# EAGLE design blink1disc_v1a (EAGLE 6.6.0)
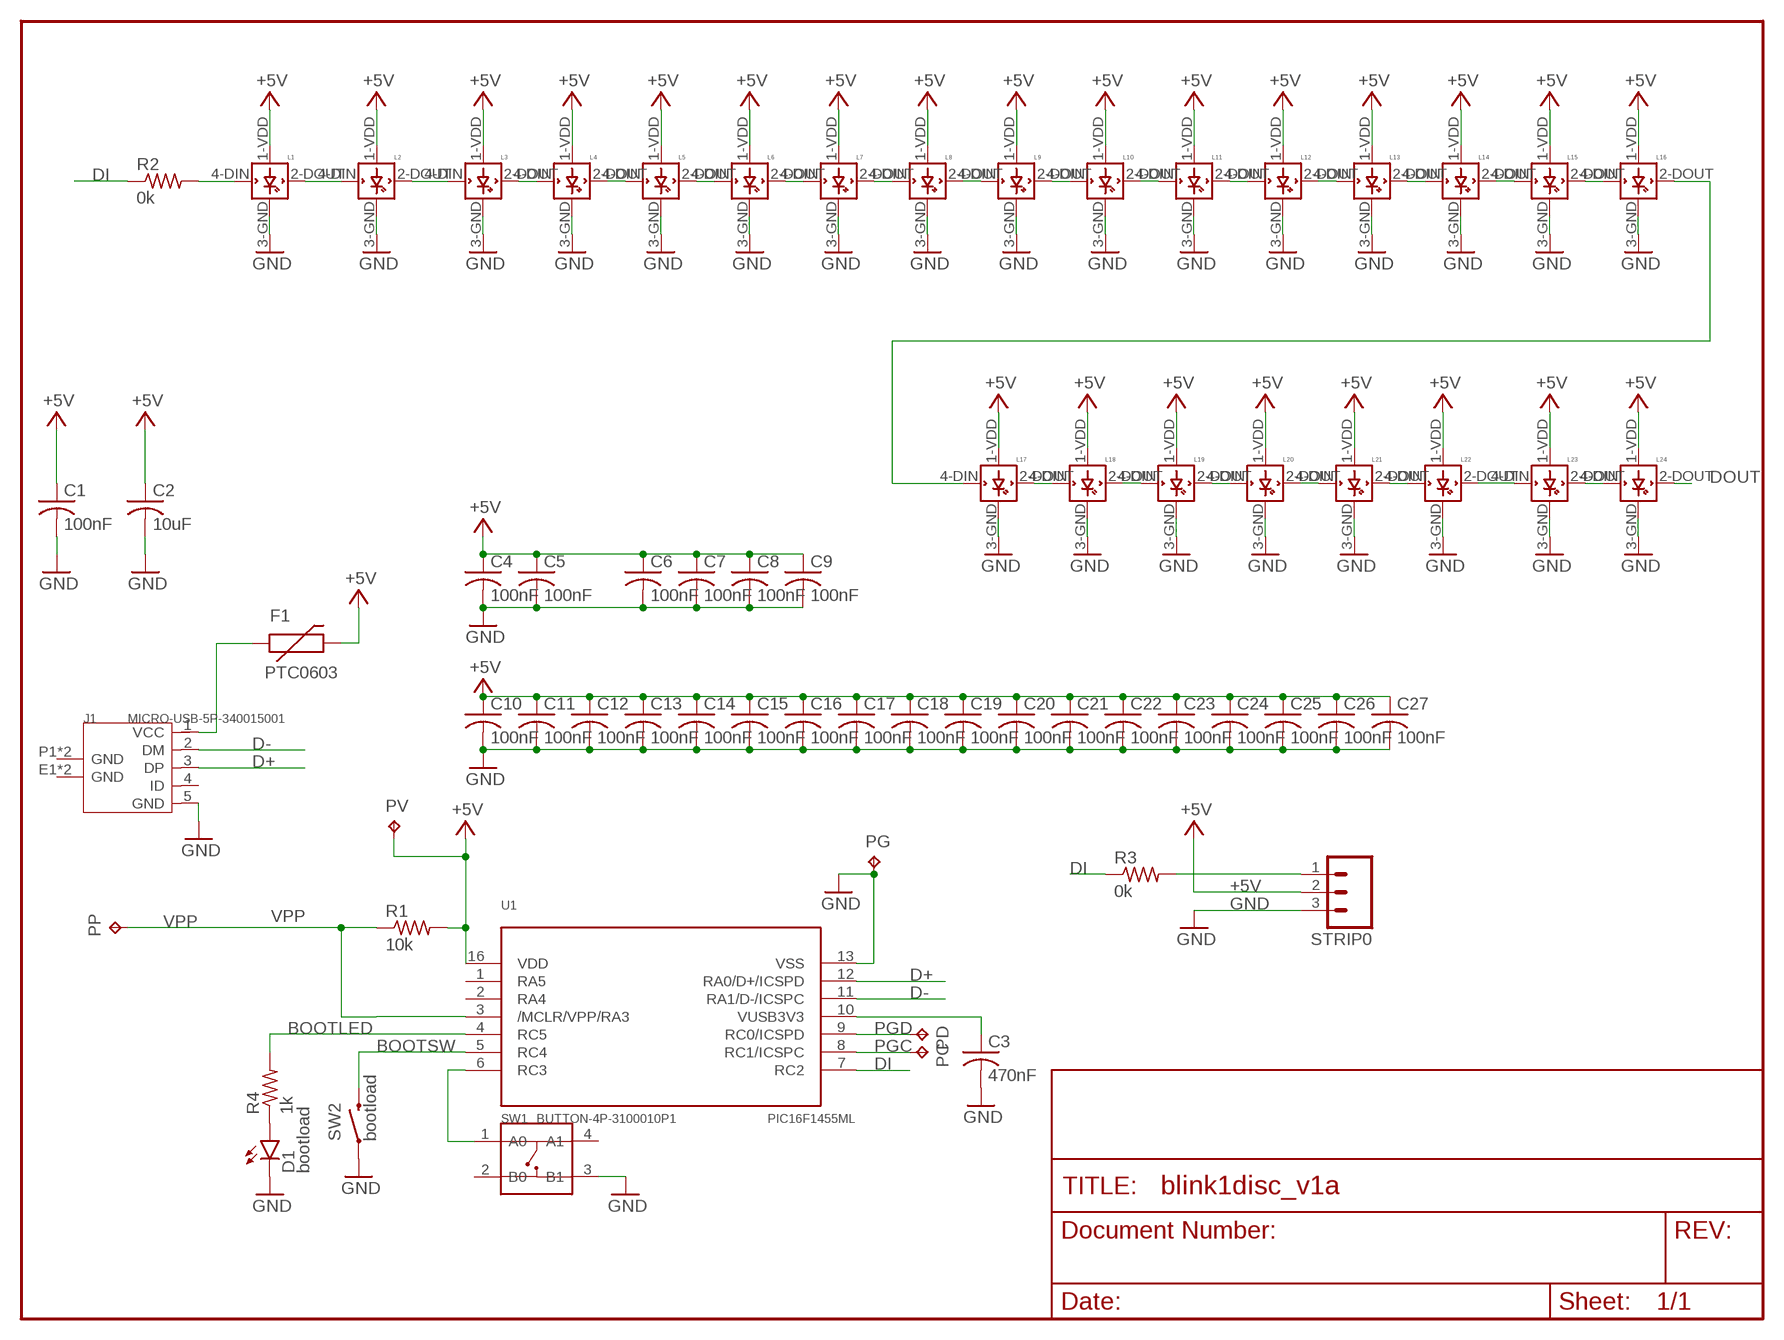
[diagram p0: schematic, sheet 1]

## Parts
C1  100nF  C-USC0603  [C0603]
C2  10uF  C-USC0603  [C0603]
C3  470nF  C-USC0603  [C0603]
C4  100nF  C-USC0603  [C0603]
C5  100nF  C-USC0603  [C0603]
C6  100nF  C-USC0603  [C0603]
C7  100nF  C-USC0603  [C0603]
C8  100nF  C-USC0603  [C0603]
C9  100nF  C-USC0603  [C0603]
C10  100nF  C-USC0603  [C0603]
C11  100nF  C-USC0603  [C0603]
C12  100nF  C-USC0603  [C0603]
C13  100nF  C-USC0603  [C0603]
C14  100nF  C-USC0603  [C0603]
C15  100nF  C-USC0603  [C0603]
C16  100nF  C-USC0603  [C0603]
C17  100nF  C-USC0603  [C0603]
C18  100nF  C-USC0603  [C0603]
C19  100nF  C-USC0603  [C0603]
C20  100nF  C-USC0603  [C0603]
C21  100nF  C-USC0603  [C0603]
C22  100nF  C-USC0603  [C0603]
C23  100nF  C-USC0603  [C0603]
C24  100nF  C-USC0603  [C0603]
C25  100nF  C-USC0603  [C0603]
C26  100nF  C-USC0603  [C0603]
C27  100nF  C-USC0603  [C0603]
D1  bootload  LED-RED0603  [LED-0603]
F1  PTC0603  [0603]
J1  MICRO-USB-5P-340015001  [B-SMD-5P]
L1  WS2812B  [WS2812B]
L2  WS2812B  [WS2812B]
L3  WS2812B  [WS2812B]
L4  WS2812B  [WS2812B]
L5  WS2812B  [WS2812B]
L6  WS2812B  [WS2812B]
L7  WS2812B  [WS2812B]
L8  WS2812B  [WS2812B]
L9  WS2812B  [WS2812B]
L10  WS2812B  [WS2812B]
L11  WS2812B  [WS2812B]
L12  WS2812B  [WS2812B]
L13  WS2812B  [WS2812B]
L14  WS2812B  [WS2812B]
L15  WS2812B  [WS2812B]
L16  WS2812B  [WS2812B]
L17  WS2812B  [WS2812B]
L18  WS2812B  [WS2812B]
L19  WS2812B  [WS2812B]
L20  WS2812B  [WS2812B]
L21  WS2812B  [WS2812B]
L22  WS2812B  [WS2812B]
L23  WS2812B  [WS2812B]
L24  WS2812B  [WS2812B]
PC  TPTP11SQ  [TP11SQ]
PD  TPTP11SQ  [TP11SQ]
PG  TPTP11SQ  [TP11SQ]
PP  TPTP11SQ  [TP11SQ]
PV  TPTP11SQ  [TP11SQ]
R1  10k  R-US_R0603  [R0603]
R2  0k  R-US_R0603  [R0603]
R3  0k  R-US_R0603  [R0603]
R4  1k  R-US_R0603  [R0603]
STRIP0  M03PTH  [1X03]
SW1  BUTTON-4P-3100010P1  [4P-SMD-6.0X6.0X5.0H]
SW2  bootload  SWITCH-MOMENTARY-2TACTILE-SWITCH-SMD-RIGHT-ANGLE  [TACTILE_SWITCH-SMD-RIGHT-ANGLE]
U1  PIC16F1455ML  [QFN16_4X4]

## Nets
+5V: C1.1 C2.1 C4.1 C5.1 C6.1 C7.1 C8.1 C9.1 C10.1 C11.1 C12.1 C13.1 C14.1 C15.1 C16.1 C17.1 C18.1 C19.1 C20.1 C21.1 C22.1 C23.1 C24.1 C25.1 C26.1 C27.1 F1.2 L1.1-VDD(VDD) L2.1-VDD(VDD) L3.1-VDD(VDD) L4.1-VDD(VDD) L5.1-VDD(VDD) L6.1-VDD(VDD) L7.1-VDD(VDD) L8.1-VDD(VDD) L9.1-VDD(VDD) L10.1-VDD(VDD) L11.1-VDD(VDD) L12.1-VDD(VDD) L13.1-VDD(VDD) L14.1-VDD(VDD) L15.1-VDD(VDD) L16.1-VDD(VDD) L17.1-VDD(VDD) L18.1-VDD(VDD) L19.1-VDD(VDD) L20.1-VDD(VDD) L21.1-VDD(VDD) L22.1-VDD(VDD) L23.1-VDD(VDD) L24.1-VDD(VDD) PV.TP R1.2 STRIP0.2 U1.16(VDD)
BOOTLED: R4.2 U1.4(RC5)
BOOTSW: SW2.2 U1.5(RC4)
D+: J1.3(DP) U1.12(RA0/D+/ICSPD)
D-: J1.2(DM) U1.11(RA1/D-/ICSPC)
DI: R2.1 R3.1 U1.7(RC2)
DO1: L2.2-DOUT(DOUT) L3.4-DIN(DIN)
DOUT: L24.2-DOUT(DOUT)
GND: C1.2 C2.2 C3.2 C4.2 C5.2 C6.2 C7.2 C8.2 C9.2 C10.2 C11.2 C12.2 C13.2 C14.2 C15.2 C16.2 C17.2 C18.2 C19.2 C20.2 C21.2 C22.2 C23.2 C24.2 C25.2 C26.2 C27.2 D1.C J1.5(GND) L1.3-GND(GND) L2.3-GND(GND) L3.3-GND(GND) L4.3-GND(GND) L5.3-GND(GND) L6.3-GND(GND) L7.3-GND(GND) L8.3-GND(GND) L9.3-GND(GND) L10.3-GND(GND) L11.3-GND(GND) L12.3-GND(GND) L13.3-GND(GND) L14.3-GND(GND) L15.3-GND(GND) L16.3-GND(GND) L17.3-GND(GND) L18.3-GND(GND) L19.3-GND(GND) L20.3-GND(GND) L21.3-GND(GND) L22.3-GND(GND) L23.3-GND(GND) L24.3-GND(GND) PG.TP STRIP0.3 SW1.3(B1) SW2.1 U1.13(VSS)
N$1: L3.2-DOUT(DOUT) L4.4-DIN(DIN)
N$2: L1.2-DOUT(DOUT) L2.4-DIN(DIN)
N$3: L5.2-DOUT(DOUT) L6.4-DIN(DIN)
N$4: L4.2-DOUT(DOUT) L5.4-DIN(DIN)
N$5: L7.2-DOUT(DOUT) L8.4-DIN(DIN)
N$6: L9.2-DOUT(DOUT) L10.4-DIN(DIN)
N$7: L8.2-DOUT(DOUT) L9.4-DIN(DIN)
N$8: L11.2-DOUT(DOUT) L12.4-DIN(DIN)
N$9: L13.2-DOUT(DOUT) L14.4-DIN(DIN)
N$10: L12.2-DOUT(DOUT) L13.4-DIN(DIN)
N$11: L1.4-DIN(DIN) R2.2
N$12: R3.2 STRIP0.1
N$14: L15.2-DOUT(DOUT) L16.4-DIN(DIN)
N$15: L14.2-DOUT(DOUT) L15.4-DIN(DIN)
N$16: SW1.1(A0) U1.6(RC3)
N$17: L6.2-DOUT(DOUT) L7.4-DIN(DIN)
N$18: L17.2-DOUT(DOUT) L18.4-DIN(DIN)
N$21: D1.A R4.1
N$22: L19.2-DOUT(DOUT) L20.4-DIN(DIN)
N$23: L18.2-DOUT(DOUT) L19.4-DIN(DIN)
N$24: L21.2-DOUT(DOUT) L22.4-DIN(DIN)
N$25: L20.2-DOUT(DOUT) L21.4-DIN(DIN)
N$26: L23.2-DOUT(DOUT) L24.4-DIN(DIN)
N$27: L22.2-DOUT(DOUT) L23.4-DIN(DIN)
N$28: L16.2-DOUT(DOUT) L17.4-DIN(DIN)
N$29: L10.2-DOUT(DOUT) L11.4-DIN(DIN)
PGC: PC.TP U1.8(RC1/ICSPC)
PGD: PD.TP U1.9(RC0/ICSPD)
VPP: PP.TP R1.1 U1.3(/MCLR/VPP/RA3)
VUSB: F1.1 J1.1(VCC)
VUSB3V3: C3.1 U1.10(VUSB3V3)
Unconnected: J1.4(ID) J1.E1(GND) J1.E2(GND) J1.P1(GND) J1.P2(GND) SW1.2(B0) SW1.4(A1) U1.1(RA5) U1.2(RA4)

## Library data of the parts
C1-C27 = rcl:C-US: CAPACITOR, American symbol
D1 = SparkFun-LED:LED-RED: Assorted Red LEDs LilyPad 1206- DIO-09912 1206- DIO-00809 0603- DIO-00819; PROD_ID: DIO-00819; VALUE: RED
F1 = SparkFun-PowerIC:PTC: Resettable Fuse PTC Resettable Fuse. Spark Fun Electronics SKU : COM-08357
J1 = OPL Eagle Library:MICRO-USB-5P: ST-USB-001E：MICRO USB B SMD R/A
L1-L24 = adafruit:WS2812B
PC PD PG PP PV = testpad:TP: Test pad
R1-R4 = rcl:R-US_: RESISTOR, American symbol
STRIP0 = SparkFun-Connectors:M03: Header 3 Standard 3-pin 0.1" header. Use with straight break away headers (SKU : PRT-00116), right angle break away headers (PRT-00553), swiss pins (PRT-00743), machine pins (PRT-00117), and female headers (PRT-00115). Molex polarized connector foot print use with SKU : PRT-08232 with associated crimp pins and housings.
SW1 = OPL Eagle Library:BUTTON-4P
SW2 = SparkFun-Electromechanical:SWITCH-MOMENTARY-2: Various NO switches- pushbuttons, reed, etc; PROD_ID: COMP-12265
U1 = todstuffnew:PIC16F1455

## Board
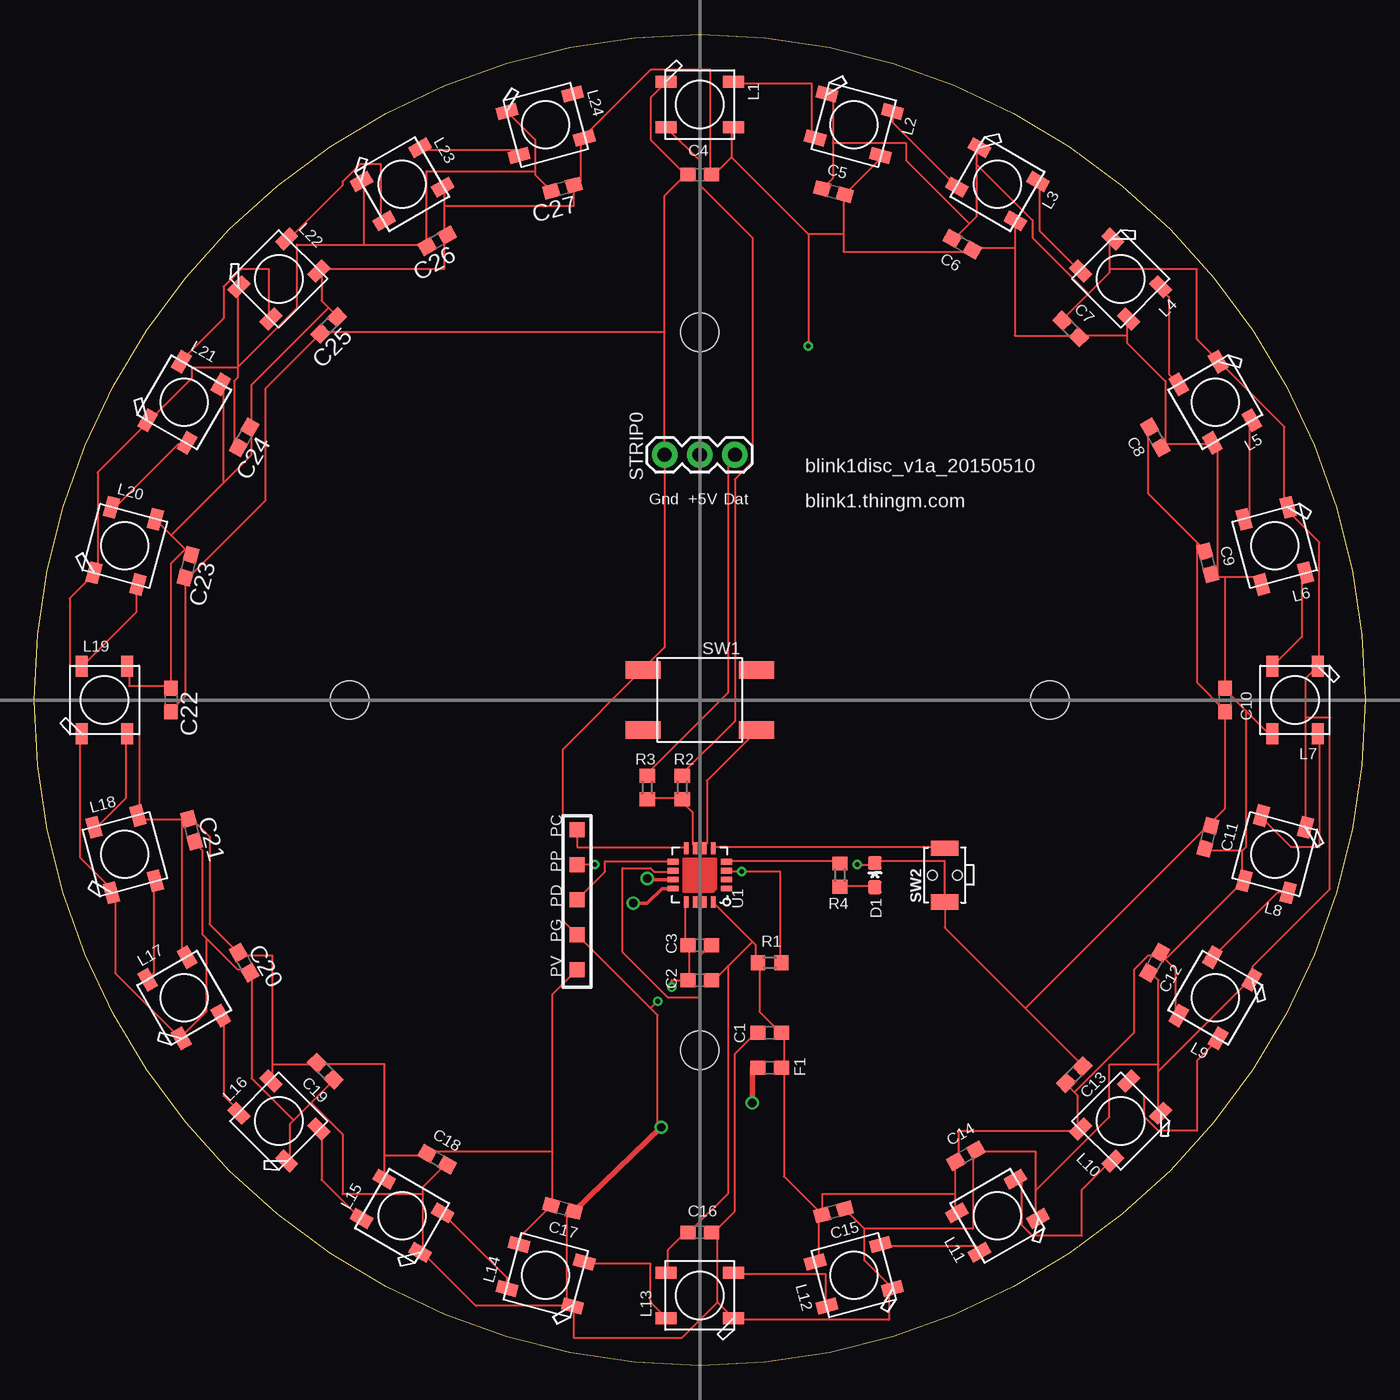
[diagram p1: board, top side]
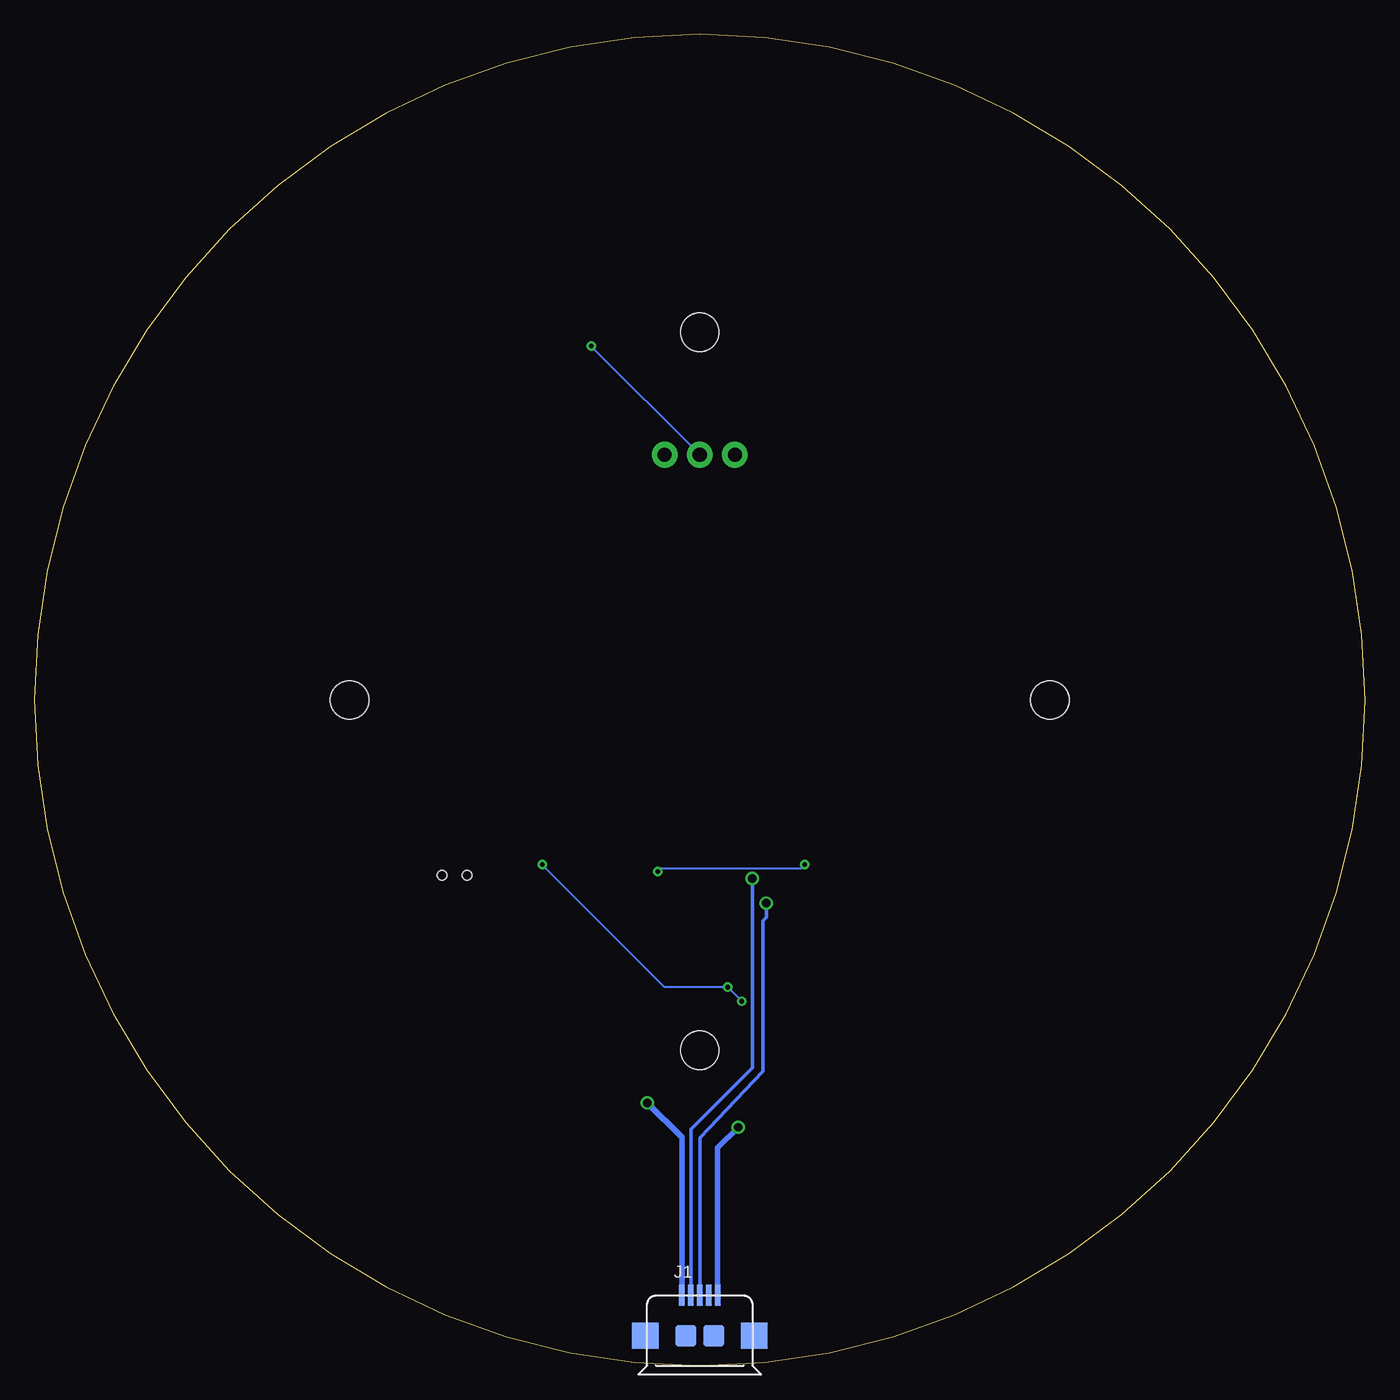
[diagram p2: board, bottom side, seen from below]

Size 96.52 x 96.52 mm. Coordinates in mm from the lower left corner, seen from the top.
Outline: 48.26,96.52 arc-180 48.26,0 arc-180 48.26,96.52
Copper layers (1*16): Top 0.0356mm / dielectric 1.5011mm / Bottom 0.0356mm
Design rules "LaenPCBOrder *": minimum track width 6mil, minimum drill 13mil, track to track 6mil, track to pad 6mil, pad to pad 6mil, via to via 6mil, smd to smd 6mil, copper to edge 15mil, drill to drill 6mil, minimum pad ring 7mil, minimum via ring 7mil, stop-mask expansion 3mil, vias tented up to drill 25mil, thermal gap 10mil
Holes 2.8 mm at 22.86,48.26 73.66,48.26 48.26,22.86 48.26,74.93

### Footprints (pad centres in the part's own frame; a part is rotated, then mirrored left to right if it is on the bottom)
C0603 = smd 1.1 x 1: 1 -0.85,0; 2 0.85,0
LED-0603 = smd 1 x 1: A 0,-0.877; C 0,0.877
0603 = smd 1.1 x 1: 1 -0.85,0; 2 0.85,0
B-SMD-5P = smd 0.38 x 1.52: 1 -1.3,2.54; 2 -0.65,2.54; 3 0,2.54; 4 0.65,2.54; 5 1.3,2.54 | smd 1.524 x 1.524: E1 -1.016,-0.381; E2 1.016,-0.381 | smd 1.9 x 1.9: P1 -3.95,-0.381; P2 3.95,-0.381
WS2812B = smd 1.5 x 0.9: 1-VDD 2.45,-1.65; 2-DOUT 2.45,1.65; 3-GND -2.45,1.65; 4-DIN -2.45,-1.65
TP11SQ = smd 1.1 x 1.1: TP 0,0
R0603 = smd 1 x 1.1: 1 -0.85,0; 2 0.85,0
1X03 = drill 1.016 pad 1.88: 1 0,0; 2 2.54,0; 3 5.08,0
4P-SMD-6.0X6.0X5.0H = smd 2.54 x 1.27: 1 -4.129,2.159; 2 -4.129,-2.159; 3 4.129,-2.159; 4 4.129,2.159
TACTILE_SWITCH-SMD-RIGHT-ANGLE = smd 1.1 x 2: 1 -1.95,0; 2 1.95,0 | hole 0.7: 0,0.9; 0,-0.9
QFN16_4X4 = smd 0.8 x 0.35: 1 -1.95,0.975; 2 -1.95,0.325; 3 -1.95,-0.325; 4 -1.95,-0.975; 9 1.95,-0.975; 10 1.95,-0.325; 11 1.95,0.325; 12 1.95,0.975 | smd 0.35 x 0.8: 5 -0.975,-1.95; 6 -0.325,-1.95; 7 0.325,-1.95; 8 0.975,-1.95; 13 0.975,1.95; 14 0.325,1.95; 15 -0.325,1.95; 16 -0.975,1.95

### Placement (x,y rotation side)
C1  53.34,24.13 180 top
C2  48.26,27.94 180 top
C3  48.26,30.48 180 top
C4  48.26,86.36 180 top
C5  57.96,85.12 165 top
C6  67.31,81.3 150 top
C7  75.17,75.17 135 top
C8  81.3,67.31 120 top
C9  85.12,58.21 105 top
C10  86.36,48.26 270 top
C11  85.12,38.31 75 top
C12  81.26,29.21 240 top
C13  75.42,21.1 45 top
C14  67.56,15.22 30 top
C15  57.96,11.15 15 top
C16  48.26,9.65 0 top
C17  38.31,11.4 345 top
C18  29.21,14.96 330 top
C19  21.1,21.35 315 top
C20  15.22,29.21 300 top
C21  11.4,38.82 285 top
C22  9.91,48.26 270 top
C23  11.15,57.96 255 top
C24  15.22,67.31 240 top
C25  21.35,75.42 225 top
C26  29.21,81.56 210 top
C27  38.31,85.37 195 top
D1  60.96,35.56 0 top
F1  53.34,21.59 0 top
J1  48.26,2.54 0 bottom
L1  48.26,91.44 0 top
L2  59.44,89.97 345 top
L3  69.85,85.65 330 top
L4  78.79,78.79 315 top
L5  85.65,69.85 300 top
L6  89.97,59.44 285 top
L7  91.44,48.26 270 top
L8  89.97,37.08 255 top
L9  85.65,26.67 240 top
L10  78.79,17.73 225 top
L11  69.85,10.87 210 top
L12  59.44,6.55 195 top
L13  48.26,5.08 180 top
L14  37.08,6.55 165 top
L15  26.67,10.87 150 top
L16  17.73,17.73 135 top
L17  10.87,26.67 120 top
L18  6.55,37.08 105 top
L19  5.08,48.26 90 top
L20  6.55,59.44 75 top
L21  10.87,69.85 60 top
L22  17.73,78.79 45 top
L23  26.67,85.65 30 top
L24  37.08,89.97 15 top
PC  39.37,38.86 90 top
PD  39.37,33.78 90 top
PG  39.37,31.24 90 top
PP  39.37,36.32 0 top
PV  39.37,28.7 90 top
R1  53.34,29.21 180 top
R2  46.99,41.91 90 top
R3  44.45,41.91 90 top
R4  58.42,35.56 90 top
STRIP0  50.8,66.04 180 top
SW1  48.26,48.26 180 top
SW2  66.04,35.56 90 top
U1  48.26,35.56 180 top

### Tracks (layer width: path | path; a pad name or v marks a point on that pad's centre or on a via)
+5V  (via drill 0.33)
  Top 0.152: 17.27,21.84 20.32,21.84 C19.1 20.57,21.84 25.4,21.84 25.4,15.24 | 17.27,21.84 17.27,20.83 L16.1-VDD | 17.27,21.84 17.27,29.72 14.99,29.72 C20.1 14.73,29.97 12.7,32 12.7,38.35 11.43,39.62 C21.1 | 25.4,15.24 28.45,15.24 C18.1 28.7,15.49 37.59,15.49 | 25.4,15.24 25.4,13.72 L15.1-VDD | L14.1-VDD 35.31,8.89 35.31,9.4 37.34,11.43 C17.1 37.59,11.68 37.59,15.49 | PV.TP 37.59,26.92 37.59,15.49 | 21.34,76.71 20.83,77.22 20.83,79.25 L22.1-VDD 20.83,79.5 29.72,79.5 29.72,81.79 C26.1 29.72,82.04 29.72,84.07 | 21.34,76.71 21.84,76.2 C25.1 | 29.72,84.07 29.72,85.34 L23.1-VDD | 29.72,84.07 39.12,84.07 39.12,85.34 C27.1 39.37,85.6 39.62,85.85 39.62,88.9 L24.1-VDD 39.88,89.15 44.7,93.98 49.02,93.98 49.02,86.36 C4.1 49.28,86.36 50.55,87.63 | 9.91,60.2 8.89,61.21 L20.1-VDD | 9.91,60.2 10.92,59.18 | 10.92,59.18 11.18,58.93 C23.1 | 9.91,60.2 13.72,64.01 | 13.72,64.01 15.75,66.04 15.75,67.82 C24.1 15.75,68.07 15.75,71.12 21.34,76.71 | 13.72,64.01 13.72,71.12 L21.1-VDD | 7.62,49.28 6.86,49.28 6.86,50.55 L19.1-VDD | 7.62,49.28 9.91,49.28 | 9.91,49.28 C22.1 9.91,49.28 | 10.67,39.62 7.62,39.62 L18.1-VDD 7.62,39.88 7.62,49.28 | 10.67,39.62 11.18,39.62 C21.1 | 10.67,39.62 10.67,29.97 10.92,29.72 L17.1-VDD | 10.67,39.62 C21.1 | 10.92,59.18 9.91,58.17 9.91,49.28 | L13.1-VDD 45.97,6.86 45.97,8.38 47.24,9.65 C16.1 47.5,9.65 50.29,12.45 50.29,28.96 | 75.44,19.81 75.69,19.56 75.69,17.27 L10.1-VDD 75.69,17.02 67.06,17.02 67.06,14.99 C14.1 66.8,14.73 66.8,12.45 | 75.44,19.81 74.93,20.32 C13.1 | 66.8,12.45 66.8,11.18 L11.1-VDD | C15.1 56.9,10.92 56.9,7.62 L12.1-VDD | 54.36,21.59 54.36,24.13 C1.1 54.1,24.13 52.58,25.65 52.58,29.21 R1.2 52.32,29.21 52.32,30.48 52.07,30.73
  Top 0.152: 54.36,21.59 F1.2 54.36,21.59 | 52.07,30.73 49.28,33.53 U1.16 | 52.07,30.73 50.29,28.96 | 50.29,28.96 49.28,27.94 C2.1 | 54.36,21.59 54.36,13.72 56.9,11.18 C15.1 | 66.8,12.45 57.15,12.45 57.15,11.18 C15.1 | 87.63,37.34 85.09,37.34 C11.1 | 87.63,37.34 87.63,35.31 L8.1-VDD 87.63,35.05 82.04,29.46 | 82.04,29.46 82.8,28.7 82.8,25.4 L9.1-VDD | 82.04,29.46 81.79,29.72 C12.1 81.53,29.72 80.77,29.72 79.76,28.7 79.76,24.13 75.44,19.81 | 87.88,47.5 89.66,45.72 L7.1-VDD | 87.88,47.5 86.36,49.02 C10.1 86.36,49.28 86.36,57.15 | 82.04,66.8 85.34,66.8 L5.1-VDD 85.6,66.8 85.85,66.55 85.85,57.15 | 82.04,66.8 81.79,66.8 C8.1 82.04,66.8 | 86.36,57.15 88.9,57.15 88.9,56.9 L6.1-VDD | 86.36,57.15 85.85,57.15 | 85.85,57.15 85.34,57.15 C9.1 85.85,57.15 | 87.63,37.34 87.88,37.59 87.88,47.5 | 79.25,74.68 75.95,74.68 C7.1 75.69,74.68 71.12,74.68 71.12,81.03 | 79.25,74.68 79.25,75.69 L4.1-VDD | 71.12,81.03 68.07,81.03 C6.1 67.82,80.77 58.67,80.77 58.67,82.04 | 71.12,81.03 71.12,82.8 L3.1-VDD | 50.55,87.63 50.55,89.66 L1.1-VDD | L2.1-VDD 61.21,87.63 61.21,87.38 58.93,85.09 C5.1 58.67,84.84 58.67,82.04 | 56.13,82.04 50.55,87.63 | 58.67,82.04 56.13,82.04 | 56.13,82.04 v56.13,73.91 | 82.04,66.8 82.04,71.37 79.25,74.17 79.25,74.68
  Bottom 0.152: v56.13,73.91 STRIP0.2
BOOTLED
  Top 0.152: U1.4 50.29,36.58 58.42,36.58 R4.2
BOOTSW
  Top 0.152: U1.5 49.28,37.59 66.04,37.59 SW2.2
D+  (via drill 0.61)
  Top 0.254: U1.12 45.51,34.59 44.45,33.53 v43.43,33.53
  Bottom 0.254: J1.3 48.26,16.51 43.69,21.34 43.69,32.26 43.43,32.51 v43.43,33.53
D-  (via drill 0.61)
  Top 0.254: U1.11 45.4,35.23 44.52,35.23 v44.45,35.31
  Bottom 0.254: J1.2 48.91,17.13 44.45,21.59 v44.45,35.31
DI
  Top 0.152: U1.7 48.01,37.59 47.75,37.85 47.75,40.13 46.99,40.89 R2.1 46.99,41.15 44.45,41.15 R3.1
DO1
  Top 0.152: L3.4-DIN 66.8,85.6 62.23,90.17 62.23,90.68 L2.2-DOUT
GND  (via drill 0.33, 0.6)
  Top 0.152: 76.45,77.72 77.98,79.25 77.98,79.5 | 76.45,77.72 74.68,75.95 C7.2 | 77.98,79.5 77.98,81.53 L4.3-GND | 57.91,88.65 57.91,91.69 57.66,91.95 L2.3-GND | 57.91,88.65 57.91,86.11 C5.2 | 67.82,82.8 68.33,83.31 68.33,87.12 | 67.82,82.8 66.8,81.79 C6.2 | 68.33,87.12 68.33,88.14 L3.3-GND | 57.91,88.65 63.25,88.65 63.25,87.38 67.82,82.8 | 76.45,77.72 72.39,81.79 72.39,83.06 68.33,87.12 | 92.2,46.99 92.2,49.78 92.96,50.55 L7.3-GND 93.22,50.8 93.22,59.69 90.93,61.98 L6.3-GND 90.68,62.23 90.68,68.07 86.11,72.64 L5.3-GND 85.85,72.9 84.33,74.42 84.33,79.5 77.98,79.5 | 92.2,46.99 92.2,39.12 L8.3-GND | C22.2 9.91,47.5 10.92,48.51 10.92,56.9 C23.2 11.18,57.15 16.76,62.74 16.76,70.87 20.57,74.68 C25.2 20.83,74.93 45.72,74.93 | 47.24,86.36 44.7,88.9 44.7,91.95 45.72,92.96 L1.3-GND | 47.24,86.36 C4.2 47.24,86.36 | 47.24,86.36 45.72,84.84 45.72,74.93 | 45.72,74.93 STRIP0.3 45.72,52.07 44.2,50.55 SW1.3 43.94,50.29 38.35,44.7 38.35,32.26 PG.TP 44.7,25.91 | 71.88,25.91 66.04,31.75 66.04,33.53 SW2.1 66.04,33.78 66.04,36.58 60.96,36.58 D1.C 60.96,36.32 v59.69,36.32 | 71.88,25.91 75.95,21.84 C13.2 | 84.33,59.69 80.77,63.25 80.77,67.82 C8.2 | 84.33,59.69 84.84,59.18 C9.2 | 84.33,59.69 84.33,49.53 86.36,47.5 C10.2 86.36,47.24 86.36,40.39 85.34,39.37 C11.2 85.09,39.12 71.88,25.91 | 49.28,9.65 49.53,9.4 49.53,4.57 | 49.53,4.57 50.55,3.56 L13.3-GND 50.8,3.3 61.98,3.3 61.98,5.59 L12.3-GND 61.98,5.84 60.2,7.62 60.2,9.91 | 49.28,9.65 C16.2 49.28,9.65 | 49.28,9.65 50.8,11.18 50.8,22.61 52.32,24.13 C1.2 | 81.53,21.34 81.53,18.54 L10.3-GND | 81.53,21.34 81.53,21.84 | 81.53,21.84 81.53,27.94 81.03,28.45 C12.2
  Top 0.152: 81.53,21.34 88.14,27.94 L9.3-GND 88.39,28.19 88.39,28.96 93.98,34.54 93.98,46.99 92.2,46.99 | 60.2,9.91 58.93,11.18 C15.2 | 72.64,12.7 72.64,10.67 L11.3-GND | 72.64,12.7 72.64,15.49 68.33,15.49 C14.2 68.07,15.49 68.07,9.91 60.2,9.91 | 81.53,21.84 77.98,21.84 77.98,18.03 72.64,12.7 | 28.19,12.45 28.19,8.38 L15.3-GND 28.19,8.13 32,4.32 38.86,4.32 L14.3-GND | 28.19,12.45 28.19,12.95 29.72,14.48 C18.2 | U1.13 47.24,33.53 47.24,30.48 C3.2 47.5,30.48 47.5,27.94 C2.2 47.24,27.94 46.23,27.94 v46.23,27.43 | 44.7,25.91 45.21,25.4 45.21,17.27 v45.47,17.27 | L14.3-GND 38.86,4.57 38.61,4.83 38.61,10.67 39.12,11.18 C17.2 | 44.7,25.91 v45.21,26.42 | 18.8,17.78 18.54,17.53 18.54,14.99 L16.3-GND | 18.8,17.78 20.07,19.05 | 20.07,19.05 21.59,20.57 C19.2 | 12.45,30.99 14.73,28.7 15.49,28.7 C20.2 15.75,28.45 15.75,20.83 18.8,17.78 | 12.45,30.99 12.19,31.24 12.19,37.34 11.68,37.85 C21.2 | 12.45,30.99 12.45,25.65 10.67,23.88 L17.3-GND 10.41,23.88 5.84,28.45 5.84,34.29 L18.3-GND 5.59,34.54 3.3,36.83 3.3,45.72 L19.3-GND 3.3,45.97 2.54,46.74 2.54,55.63 4.32,57.4 L20.3-GND 4.57,57.66 4.57,64.77 8.13,68.33 L21.3-GND 8.38,68.58 11.43,71.63 11.43,72.39 14.73,72.39 | 36.32,86.61 36.32,88.9 34.54,90.68 L24.3-GND | 36.32,86.61 36.32,86.36 37.34,85.34 C27.2 | 23.88,81.28 28.45,81.28 | 23.88,81.28 23.88,85.85 L23.3-GND | 28.45,81.28 C26.2 28.45,81.28 | 36.32,86.61 28.45,86.61 28.45,81.28 | 14.73,72.39 14.73,77.98 L22.3-GND | 14.73,72.39 14.73,71.63 14.48,71.37 14.48,67.06 14.73,66.8 C24.2 | 23.88,81.28 19.05,81.28 19.05,76.71 14.73,72.39 | 28.19,12.45 22.35,12.45 22.35,16.76 20.07,19.05 | 49.53,4.57 46.99,2.03 39.12,2.03 39.12,4.32 L14.3-GND
  Top 0.406: v45.47,17.27 C17.2
  Bottom 0.152: v45.21,26.42 v46.23,27.43 50.8,27.43 v59.69,36.32
  Bottom 0.406: J1.5 46.96,15.78 v45.47,17.27
N$1
  Top 0.152: L4.4-DIN 75.69,79.5 72.9,82.3 72.9,85.85 L3.2-DOUT
N$2
  Top 0.152: L1.2-DOUT 50.8,92.96 56.39,92.96 56.39,89.41 56.64,89.15 L2.4-DIN
N$3
  Top 0.152: L6.4-DIN 87.88,61.47 88.14,61.72 88.14,68.33 L5.2-DOUT
N$4
  Top 0.152: L5.4-DIN 82.8,71.37 82.3,71.88 82.3,77.47 81.79,77.98 L4.2-DOUT
N$5
  Top 0.152: L8.4-DIN 89.15,39.62 91.19,37.59 93.22,37.59 93.22,45.72 L7.2-DOUT
N$6
  Top 0.152: L10.4-DIN 79.5,20.57 80.52,19.56 80.52,18.03 81.53,17.02 84.33,17.02 84.33,22.1 85.85,23.62 L9.2-DOUT
N$7
  Top 0.152: L9.4-DIN 85.6,29.72 90.17,34.29 90.68,34.29 L8.2-DOUT
N$8
  Top 0.152: L12.4-DIN 61.47,8.64 68.33,8.64 68.33,8.38 L11.2-DOUT
N$9
  Top 0.152: L14.4-DIN 39.88,7.37 44.7,7.37 44.7,4.57 45.72,3.56 L13.2-DOUT
N$10
  Top 0.152: L13.4-DIN 50.8,6.6 57.4,6.6 57.4,4.57 L12.2-DOUT
N$11
  Top 0.152: R2.2 46.99,42.93 50.8,46.74 50.8,64.26 52.07,65.53 52.07,81.79 48.26,85.6 48.26,87.38 45.97,89.66 L1.4-DIN
N$12
  Top 0.152: STRIP0.1 50.29,65.53 50.29,48.77 44.45,42.93 R3.2
N$14
  Top 0.152: L15.2-DOUT 23.62,10.67 20.83,13.46 20.83,17.02 L16.4-DIN
N$15
  Top 0.152: L15.4-DIN 29.72,10.92 34.29,6.35 34.29,5.84 L14.2-DOUT
N$16
  Top 0.152: U1.6 48.51,37.59 48.77,37.85 48.77,42.42 52.32,45.97 SW1.1
N$17
  Top 0.152: L7.4-DIN 89.92,50.8 91.95,52.83 91.95,57.4 L6.2-DOUT
N$18
  Top 0.152: L17.2-DOUT 8.38,28.19 8.64,28.45 8.64,35.05 L18.4-DIN
N$21
  Top 0.152: D1.A 60.96,34.8 58.42,34.8 R4.1
N$22
  Top 0.152: L19.2-DOUT 3.56,50.8 7.37,54.61 7.37,56.64 L20.4-DIN
N$23
  Top 0.152: L18.2-DOUT 4.57,39.12 6.6,41.15 6.6,45.72 L19.4-DIN
N$24
  Top 0.152: L21.2-DOUT 10.67,72.9 13.72,75.95 13.72,78.23 14.99,79.5 17.02,79.5 17.02,75.95 L22.4-DIN
N$25
  Top 0.152: L20.2-DOUT 5.84,62.23 10.41,66.8 10.92,66.8 L21.4-DIN
N$26
  Top 0.152: L23.2-DOUT 28.19,88.14 35.05,88.14 35.05,87.88 L24.4-DIN
N$27
  Top 0.152: L22.2-DOUT 18.54,81.79 22.35,85.6 22.35,85.85 23.62,87.12 25.15,87.12 25.15,83.06 L23.4-DIN
N$28
  Top 0.152: L16.2-DOUT 14.73,18.54 13.72,19.56 13.72,25.15 L17.4-DIN
N$29
  Top 0.152: L11.4-DIN 71.37,13.46 71.63,13.21 71.63,10.16 72.39,9.4 75.95,9.4 75.95,12.7 77.98,14.73 L10.2-DOUT
PGC
  Top 0.152: PC.TP 39.37,37.59 47.24,37.59 U1.8
PGD
  Top 0.152: PD.TP 41.4,35.81 41.4,36.58 46.23,36.58 U1.9
VPP  (via drill 0.33)
  Top 0.152: U1.3 50.29,35.81 v51.31,35.81 54.1,35.81 54.1,29.21 R1.1 | v40.64,36.32 PP.TP
  Bottom 0.152: v40.64,36.32 40.89,36.07 51.05,36.07 v51.31,35.81
VUSB  (via drill 0.61)
  Top 0.406: v52.07,19.05 52.07,21.59 F1.1
  Bottom 0.406: J1.1 49.56,16.54 v52.07,19.05
VUSB3V3
  Top 0.152: U1.10 46.23,35.81 44.96,35.81 44.7,36.07 42.67,36.07 42.67,29.97 45.97,26.67 48.26,26.67 48.26,29.72 49.02,30.48 C3.1

### Text on the board
tNames: blink1disc_v1a_20150510 | Gnd | +5V | Dat | blink1.thingm.com